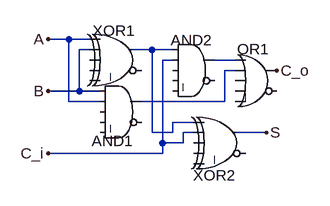
[diagram p0: schematic one_bit_adder.asc]
one_bit_adder.asc, the LTspice schematic file:
Version 4
SHEET 1 880 680
WIRE 48 64 16 64
WIRE 80 64 48 64
WIRE 80 80 64 80
WIRE 176 80 144 80
WIRE 208 80 176 80
WIRE 208 96 192 96
WIRE 304 96 272 96
WIRE 304 112 288 112
WIRE 64 144 64 80
WIRE 64 144 16 144
WIRE 96 144 64 144
WIRE 48 160 48 64
WIRE 96 160 48 160
WIRE 288 160 288 112
WIRE 288 160 160 160
WIRE 240 192 208 192
WIRE 176 208 176 80
WIRE 208 208 208 192
WIRE 208 208 176 208
WIRE 240 208 224 208
WIRE 352 208 304 208
WIRE 192 224 192 96
WIRE 224 224 224 208
WIRE 224 224 192 224
WIRE 192 240 192 224
WIRE 192 240 16 240
FLAG 16 64 A
FLAG 16 144 B
FLAG 16 240 C_i
FLAG 352 208 S
FLAG 368 112 C_o
SYMBOL Digital\\xor 128 32 R0
WINDOW 0 -43 19 Left 2
SYMATTR InstName XOR1
SYMBOL Digital\\and 128 112 R0
WINDOW 0 -45 109 Left 2
SYMATTR InstName AND1
SYMBOL Digital\\and 240 48 R0
WINDOW 0 -35 17 Left 2
SYMATTR InstName AND2
SYMBOL Digital\\xor 288 160 R0
WINDOW 0 -49 114 Left 2
SYMATTR InstName XOR2
SYMBOL Digital\\or 336 64 R0
WINDOW 0 -29 15 Left 2
SYMATTR InstName OR1

The netlist it stands for:
* one_bit_adder.asc
A§XOR1 A B 0 0 0 0 N001 0 XOR
AND1 B A 0 0 0 0 N003 0 AND
AND2 N001 C_i 0 0 0 0 N002 0 AND
A§XOR2 N001 C_i 0 0 0 0 S 0 XOR
A§OR1 N002 N003 0 0 0 0 C_o 0 OR
.backanno
.end